# EAGLE design QFN44-2-DIP (EAGLE 6.6.0)
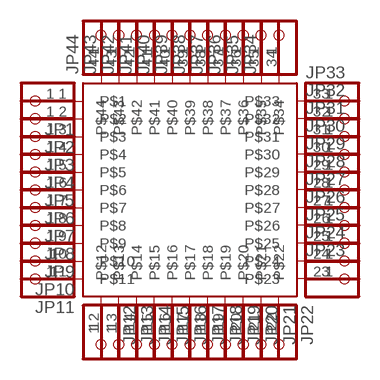
[diagram p0: schematic, sheet 1]

## Parts
JP1  PINHD-1X1  [1X01]
JP2  PINHD-1X1  [1X01]
JP3  PINHD-1X1  [1X01]
JP4  PINHD-1X1  [1X01]
JP5  PINHD-1X1  [1X01]
JP6  PINHD-1X1  [1X01]
JP7  PINHD-1X1  [1X01]
JP8  PINHD-1X1  [1X01]
JP9  PINHD-1X1  [1X01]
JP10  PINHD-1X1  [1X01]
JP11  PINHD-1X1  [1X01]
JP12  PINHD-1X1  [1X01]
JP13  PINHD-1X1  [1X01]
JP14  PINHD-1X1  [1X01]
JP15  PINHD-1X1  [1X01]
JP16  PINHD-1X1  [1X01]
JP17  PINHD-1X1  [1X01]
JP18  PINHD-1X1  [1X01]
JP19  PINHD-1X1  [1X01]
JP20  PINHD-1X1  [1X01]
JP21  PINHD-1X1  [1X01]
JP22  PINHD-1X1  [1X01]
JP23  PINHD-1X1  [1X01]
JP24  PINHD-1X1  [1X01]
JP25  PINHD-1X1  [1X01]
JP26  PINHD-1X1  [1X01]
JP27  PINHD-1X1  [1X01]
JP28  PINHD-1X1  [1X01]
JP29  PINHD-1X1  [1X01]
JP30  PINHD-1X1  [1X01]
JP31  PINHD-1X1  [1X01]
JP32  PINHD-1X1  [1X01]
JP33  PINHD-1X1  [1X01]
JP34  PINHD-1X1  [1X01]
JP35  PINHD-1X1  [1X01]
JP36  PINHD-1X1  [1X01]
JP37  PINHD-1X1  [1X01]
JP38  PINHD-1X1  [1X01]
JP39  PINHD-1X1  [1X01]
JP40  PINHD-1X1  [1X01]
JP41  PINHD-1X1  [1X01]
JP42  PINHD-1X1  [1X01]
JP43  PINHD-1X1  [1X01]
JP44  PINHD-1X1  [1X01]
U$1  3M44  [3M44]

## Nets
N$1: JP1.1 U$1.1
N$2: JP2.1 U$1.2
N$3: JP3.1 U$1.3
N$4: JP4.1 U$1.4
N$5: JP5.1 U$1.5
N$6: JP6.1 U$1.6
N$7: JP7.1 U$1.7
N$8: JP8.1 U$1.8
N$9: JP9.1 U$1.9
N$10: JP10.1 U$1.10
N$11: JP11.1 U$1.11
N$12: JP12.1 U$1.12
N$13: JP13.1 U$1.13
N$14: JP14.1 U$1.14
N$15: JP15.1 U$1.15
N$16: JP16.1 U$1.16
N$17: JP17.1 U$1.17
N$18: JP18.1 U$1.18
N$19: JP19.1 U$1.19
N$20: JP20.1 U$1.20
N$21: JP21.1 U$1.21
N$22: JP22.1 U$1.22
N$23: JP23.1 U$1.23
N$24: JP24.1 U$1.24
N$25: JP25.1 U$1.25
N$26: JP26.1 U$1.26
N$27: JP27.1 U$1.27
N$28: JP28.1 U$1.28
N$29: JP29.1 U$1.29
N$30: JP30.1 U$1.30
N$31: JP31.1 U$1.31
N$32: JP32.1 U$1.32
N$33: JP33.1 U$1.33
N$34: JP34.1 U$1.34
N$35: JP35.1 U$1.35
N$36: JP36.1 U$1.36
N$37: JP37.1 U$1.37
N$38: JP38.1 U$1.38
N$39: JP39.1 U$1.39
N$40: JP40.1 U$1.40
N$41: JP41.1 U$1.41
N$42: JP42.1 U$1.42
N$43: JP43.1 U$1.43
N$44: JP44.1 U$1.44

## Library data of the parts
JP1-JP44 = adafruit:PINHD-1X1: Pin header 1x1 for 0.1" spacing With round pins
U$1 = plcc-socket:3M44: PLCC QFN-44 to DIP Socket

## Board
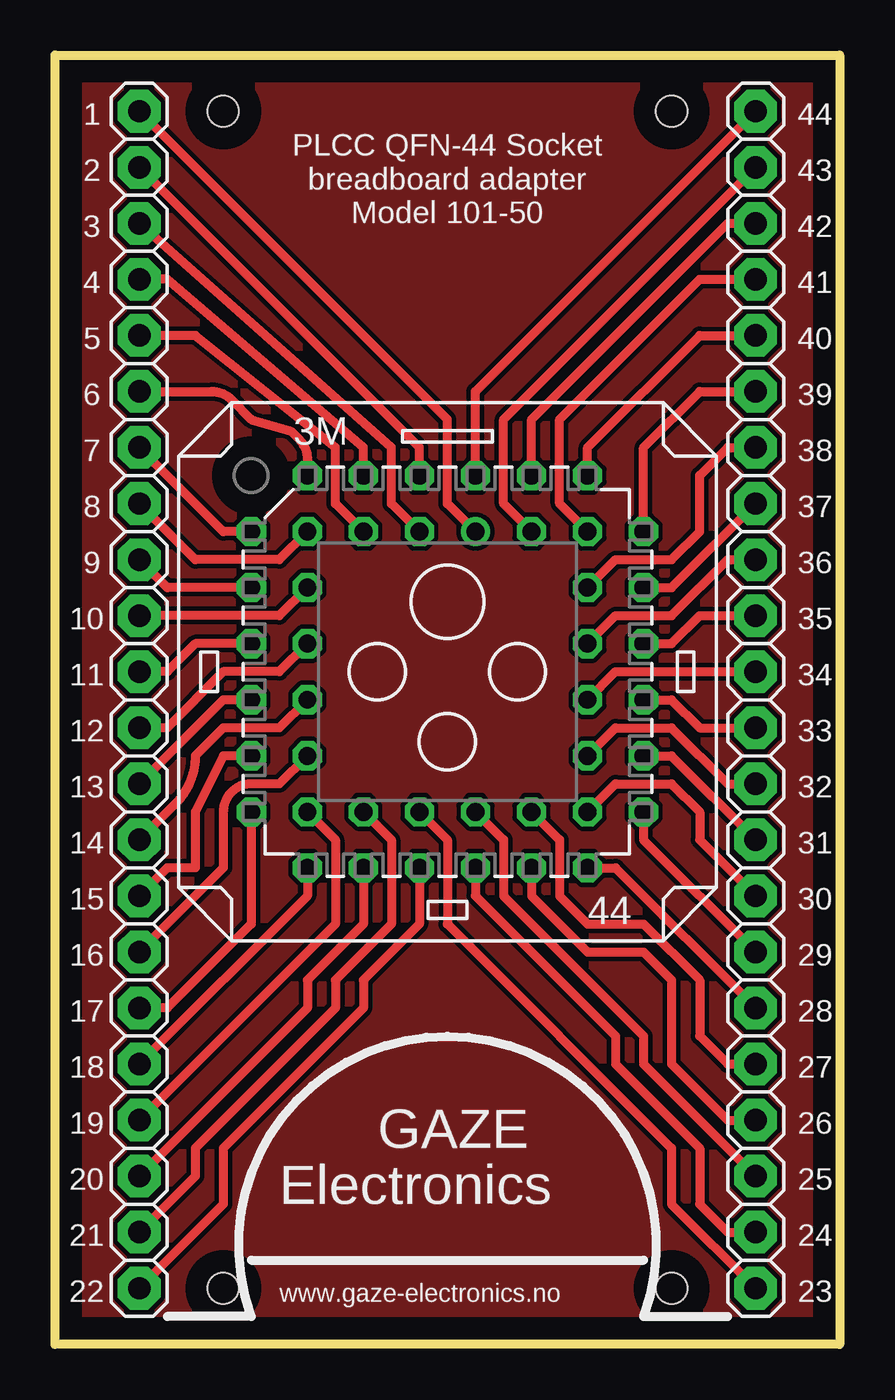
[diagram p1: board, top side]

Size 35.56 x 58.42 mm. Coordinates in mm from the lower left corner, seen from the top.
Outline: 0,58.42 35.56,58.42 35.56,0 0,0 0,58.42
Copper layers (1*16): Top 0.035mm / dielectric 1.5mm / Bottom 0.035mm
Design rules "default": minimum track width 10mil, minimum drill 24mil, track to track 8mil, track to pad 8mil, pad to pad 8mil, via to via 8mil, smd to smd 8mil, copper to edge 40mil, drill to drill 8mil, minimum pad ring 10mil, minimum via ring 8mil, stop-mask expansion 4mil, vias tented up to drill 0mil, thermal gap 10mil
Holes 1.4 mm at 7.62,55.88 27.94,55.88 7.62,2.54 27.94,2.54

### Footprints (pad centres in the part's own frame; a part is rotated, then mirrored left to right if it is on the bottom)
1X01 = drill 1.016 pad 1.93 octagon: 1 0,0
3M44 = drill 0.813: 1 1.27,6.35 | drill 0.813 octagon: 2 -1.27,8.89; 3 -1.27,6.35; 4 -3.81,8.89; 5 -3.81,6.35; 6 -6.35,8.89; 7 -8.89,6.35; 8 -6.35,6.35; 9 -8.89,3.81; 10 -6.35,3.81; 11 -8.89,1.27; 12 -6.35,1.27; 13 -8.89,-1.27; 14 -6.35,-1.27; 15 -8.89,-3.81; 16 -6.35,-3.81; 17 -8.89,-6.35; 18 -6.35,-8.89; 19 -6.35,-6.35; 20 -3.81,-8.89; 21 -3.81,-6.35; 22 -1.27,-8.89; 23 -1.27,-6.35; 24 1.27,-8.89; 25 1.27,-6.35; 26 3.81,-8.89; 27 3.81,-6.35; 28 6.35,-8.89; 29 8.89,-6.35; 30 6.35,-6.35; 31 8.89,-3.81; 32 6.35,-3.81; 33 8.89,-1.27; 34 6.35,-1.27; 35 8.89,1.27; 36 6.35,1.27; 37 8.89,3.81; 38 6.35,3.81; 39 8.89,6.35; 40 6.35,8.89; 41 6.35,6.35; 42 3.81,8.89; 43 3.81,6.35; 44 1.27,8.89 | hole 1.499: -8.89,8.89

### Placement (x,y rotation side)
JP1  3.81,55.88 0 top
JP2  3.81,53.34 0 top
JP3  3.81,50.8 0 top
JP4  3.81,48.26 0 top
JP5  3.81,45.72 0 top
JP6  3.81,43.18 0 top
JP7  3.81,40.64 0 top
JP8  3.81,38.1 0 top
JP9  3.81,35.56 0 top
JP10  3.81,33.02 0 top
JP11  3.81,30.48 0 top
JP12  3.81,27.94 0 top
JP13  3.81,25.4 0 top
JP14  3.81,22.86 0 top
JP15  3.81,20.32 0 top
JP16  3.81,17.78 0 top
JP17  3.81,15.24 0 top
JP18  3.81,12.7 0 top
JP19  3.81,10.16 0 top
JP20  3.81,7.62 0 top
JP21  3.81,5.08 0 top
JP22  3.81,2.54 0 top
JP23  31.75,2.54 0 top
JP24  31.75,5.08 0 top
JP25  31.75,7.62 0 top
JP26  31.75,10.16 0 top
JP27  31.75,12.7 0 top
JP28  31.75,15.24 0 top
JP29  31.75,17.78 0 top
JP30  31.75,20.32 0 top
JP31  31.75,22.86 0 top
JP32  31.75,25.4 0 top
JP33  31.75,27.94 0 top
JP34  31.75,30.48 0 top
JP35  31.75,33.02 0 top
JP36  31.75,35.56 0 top
JP37  31.75,38.1 0 top
JP38  31.75,40.64 0 top
JP39  31.75,43.18 0 top
JP40  31.75,45.72 0 top
JP41  31.75,48.26 0 top
JP42  31.75,50.8 0 top
JP43  31.75,53.34 0 top
JP44  31.75,55.88 0 top
U$1  17.78,30.48 0 top

### Tracks (layer width: path | path; a pad name or v marks a point on that pad's centre or on a via)
N$1
  Top 0.406: U$1.1 17.78,38.1 17.78,41.91 JP1.1
N$2
  Top 0.406: U$1.2 16.51,40.64 JP2.1
N$3
  Top 0.406: U$1.3 15.24,38.1 15.24,40.64 JP3.1
N$4
  Top 0.406: U$1.4 13.97,40.64 5.08,48.26 JP4.1
N$5
  Top 0.406: U$1.5 12.7,38.1 12.7,40.64 6.35,45.72 JP5.1
N$6
  Top 0.406: JP6.1 7.09,43.18 arc-45 7.99,42.81 8.89,41.91 10.69,41.38 11.06,41.01 arc-45 11.43,40.11 U$1.6
N$7
  Top 0.406: U$1.7 7.62,36.83 JP7.1
N$8
  Top 0.406: U$1.8 10.16,35.56 6.35,35.56 JP8.1
N$9
  Top 0.254: 5.03,34.29 3.89,35.43 JP9.1
  Top 0.406: U$1.9 5.08,34.29 JP9.1
N$10
  Top 0.406: U$1.10 10.16,33.02 JP10.1
N$11
  Top 0.406: U$1.11 6.35,31.75 5.08,30.48 JP11.1
N$12
  Top 0.406: U$1.12 10.16,30.48 7.62,30.48 5.08,27.94 JP12.1
N$13
  Top 0.406: U$1.13 7.62,29.21 JP13.1
N$14
  Top 0.406: U$1.14 10.16,27.94 7.62,27.94 6.35,26.67 arc-45 5.45,24.5 JP14.1
N$15
  Top 0.406: U$1.15 7.62,26.67 6.35,24.13 6.35,21.59 5.08,21.59 JP15.1
N$16
  Top 0.406: U$1.16 10.16,25.4 8.89,25.4 arc90 7.62,24.13 7.62,21.59 JP16.1
N$17
  Top 0.406: U$1.17 8.89,19.05 5.08,15.24 JP17.1
N$18
  Top 0.406: U$1.18 11.43,20.32 JP18.1
N$19
  Top 0.406: U$1.19 12.7,22.86 12.7,19.05 JP19.1
N$20
  Top 0.406: U$1.20 13.97,19.05 11.43,16.51 11.43,15.24 JP20.1
N$21
  Top 0.406: U$1.21 15.24,22.86 15.24,19.05 12.7,16.51 12.7,15.24 6.35,8.89 6.35,7.62 JP21.1
N$22
  Top 0.406: U$1.22 16.51,19.05 13.97,16.51 13.97,15.24 7.62,8.89 7.62,6.35 JP22.1
N$23
  Top 0.406: U$1.23 17.78,22.86 17.78,19.05 27.94,8.89 27.94,6.35 JP23.1
N$24
  Top 0.406: U$1.24 19.05,20.32 25.4,13.97 25.4,12.7 29.21,8.89 29.21,6.35 30.48,5.08 JP24.1
N$25
  Top 0.406: U$1.25 20.32,22.86 20.32,20.32 26.67,13.97 26.67,12.7 JP25.1
N$26
  Top 0.406: U$1.26 21.59,20.32 24.13,17.78 26.67,17.78 27.94,16.51 27.94,12.7 30.48,10.16 JP26.1
N$27
  Top 0.406: U$1.27 22.86,22.86 22.86,20.32 24.13,19.05 26.67,19.05 29.21,16.51 29.21,13.97 30.48,12.7 JP27.1
N$28
  Top 0.406: U$1.28 25.4,21.59 JP28.1
N$29
  Top 0.406: U$1.29 26.67,22.86 JP29.1
N$30
  Top 0.406: U$1.30 25.4,25.4 27.94,25.4 29.21,24.13 29.21,22.86 JP30.1
N$31
  Top 0.406: U$1.31 27.94,26.67 JP31.1
N$32
  Top 0.406: U$1.32 25.4,27.94 27.94,27.94 30.48,25.4 JP32.1
N$33
  Top 0.406: U$1.33 27.94,29.21 29.21,27.94 JP33.1
N$34
  Top 0.406: U$1.34 25.4,30.48 JP34.1
N$35
  Top 0.406: U$1.35 27.94,31.75 29.21,33.02 JP35.1
N$36
  Top 0.406: U$1.36 25.4,33.02 27.94,33.02 30.48,35.56 JP36.1
N$37
  Top 0.406: U$1.37 27.94,34.29 JP37.1
N$38
  Top 0.406: U$1.38 25.4,35.56 27.94,35.56 29.21,36.83 29.21,39.37 30.48,40.64 JP38.1
N$39
  Top 0.406: U$1.39 26.67,40.64 29.21,43.18 JP39.1
N$40
  Top 0.406: U$1.40 24.13,40.64 29.21,45.72 JP40.1
N$41
  Top 0.406: U$1.41 22.86,38.1 22.86,41.91 29.21,48.26 JP41.1
N$42
  Top 0.406: U$1.42 21.59,41.91 30.48,50.8 JP42.1
N$43
  Top 0.406: U$1.43 20.32,38.1 20.32,41.91 JP43.1
N$44
  Top 0.406: U$1.44 19.05,43.18 JP44.1
N$45
  pour Top: 0,0 0,58.42 35.56,58.42 35.56,0

### Text on the board
tPlace: 1 | 44 | 2 | 43 | PLCC QFN-44 Socket / breadboard adapter / Model 101-50 | 3 | 42 | 4 | 41 | 5 | 40 | 6 | 39 | 7 | 38 | 8 | 37 | 9 | 36 | 10 | 35 | 11 | 34 | 12 | 33 | 13 | 32 | 14 | 31 | 15 | 30 | 16 | 29 | 17 | 28 | 18 | 27 | 19 | 26 | GAZE | 20 | 25 | Electronics | 21 | 24 | 22 | www.gaze-electronics.no | 23